# EAGLE design Pinball10 (EAGLE 7.7.0)

## Sheet 1 of 7: Main
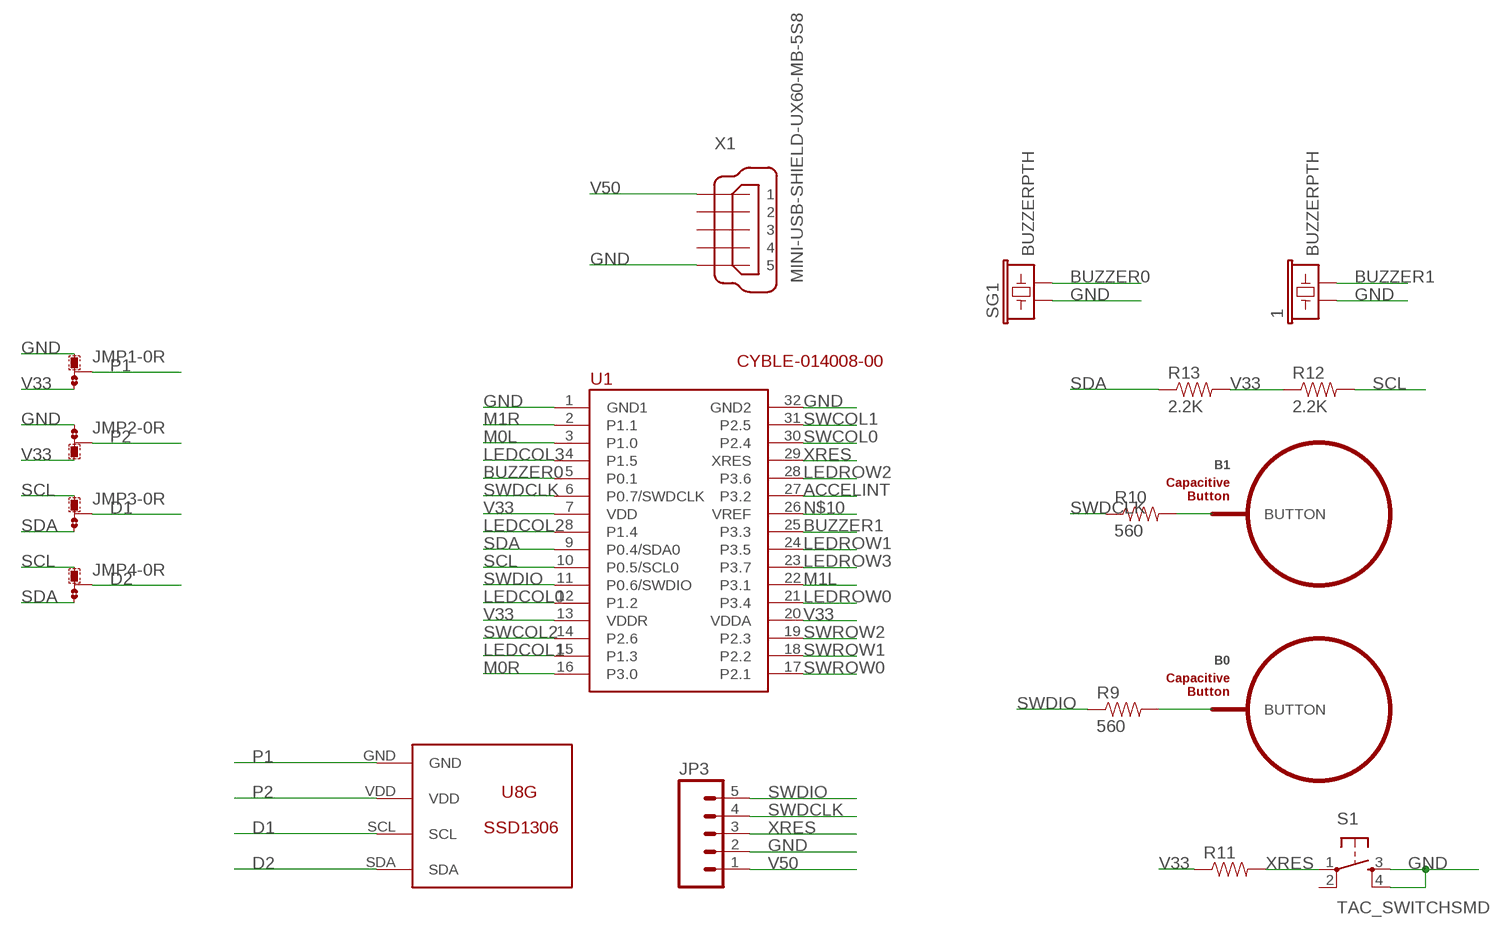
[diagram p0: schematic, sheet 1]

### Parts
1  BUZZERPTH  [BUZZER-12MM]
B0  BUTTON_PASSIVE12MM  [BUTTON_PASSIVE_12MM]
B1  BUTTON_PASSIVE12MM  [BUTTON_PASSIVE_12MM]
JMP1  0R-JUMPB  [B0R-JMP]
JMP2  0R-JUMPB  [B0R-JMP]
JMP3  0R-JUMPB  [B0R-JMP]
JMP4  0R-JUMPB  [B0R-JMP]
JP3  M05LOCK  [1X05_LOCK]
R9  560  RESISTOR0805-RES  [0805]
R10  560  RESISTOR0805-RES  [0805]
R11  RESISTOR0805-RES  [0805]
R12  2.2K  RESISTOR0805-RES  [0805]
R13  2.2K  RESISTOR0805-RES  [0805]
S1  TAC_SWITCHSMD  [TACTILE-SWITCH-SMD]
SG1  BUZZERPTH  [BUZZER-12MM]
U1  CYBLE-014008-00  [PSOC-BLE-11MM-32]
U$2  U8G-096-OLED  [096-SSD1306]
X1  MINI-USB-SHIELD-UX60-MB-5S8  [UX60-MB-5S8]

### Nets
ACCELINT: U1.27(P3.2)
BUZZER0: SG1.- U1.5(P0.1)
BUZZER1: 1.- U1.25(P3.3)
D1: JMP3.2 U$2.SCL
D2: JMP4.2 U$2.SDA
GND [power]: 1.+ JMP1.1 JMP2.1 JP3.2 S1.3 S1.4 SG1.+ U1.1(GND1) U1.32(GND2) X1.5 ; also sheet 4,5,6,7
LEDCOL0: U1.12(P1.2) ; also sheet 2
LEDCOL1: U1.15(P1.3) ; also sheet 2
LEDCOL2: U1.8(P1.4) ; also sheet 2
LEDCOL3: U1.4(P1.5) ; also sheet 2
LEDROW0: U1.21(P3.4) ; also sheet 2
LEDROW1: U1.24(P3.5) ; also sheet 2
LEDROW2: U1.28(P3.6) ; also sheet 2
LEDROW3: U1.23(P3.7) ; also sheet 2
M0L: U1.3(P1.0) ; also sheet 6
M0R: U1.16(P3.0) ; also sheet 6
M1L: U1.22(P3.1) ; also sheet 6
M1R: U1.2(P1.1) ; also sheet 6
N$3: B0.BUTTON R9.2
N$10: U1.26(VREF)
N$11: B1.BUTTON R10.2
P1 [power]: JMP1.2 U$2.GND
P2 [power]: JMP2.2 U$2.VDD
SCL: JMP3.1 JMP4.1 R12.2 U1.10(P0.5/SCL0) ; also sheet 4
SDA: JMP3.3 JMP4.3 R13.1 U1.9(P0.4/SDA0) ; also sheet 4
SWCOL0: U1.30(P2.4) ; also sheet 3
SWCOL1: U1.31(P2.5) ; also sheet 3
SWCOL2: U1.14(P2.6) ; also sheet 3
SWDCLK: JP3.4 R10.1 U1.6(P0.7/SWDCLK)
SWDIO: JP3.5 R9.1 U1.11(P0.6/SWDIO)
SWROW0: U1.17(P2.1) ; also sheet 3
SWROW1: U1.18(P2.2) ; also sheet 3
SWROW2: U1.19(P2.3) ; also sheet 3
V33 [power]: JMP1.3 JMP2.3 R11.1 R12.1 R13.2 U1.7(VDD) U1.13(VDDR) U1.20(VDDA) ; also sheet 4,5,6,7
V50 [power]: JP3.1 X1.1 ; also sheet 5,6,7
XRES: JP3.3 R11.2 S1.1 U1.29(XRES)
Unconnected: S1.2 X1.2 X1.3 X1.4 X1.M1(S1) X1.M2(S2) X1.M3(S3) X1.M4(S4)

## Sheet 2 of 7: LEDS
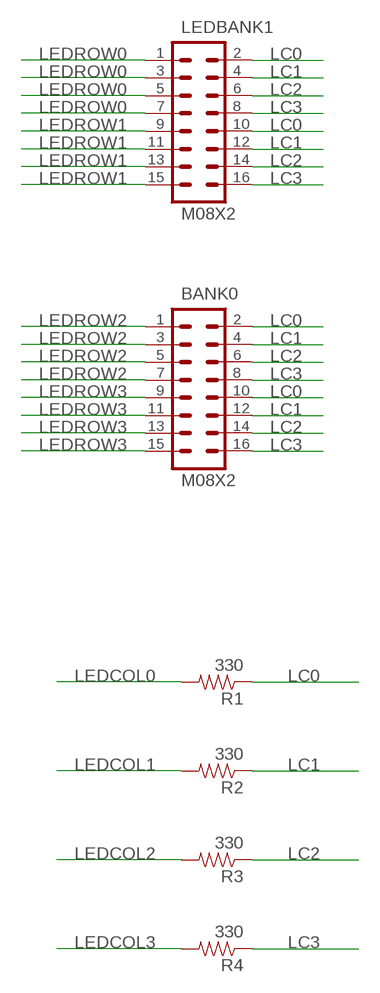
[diagram p1: schematic, sheet 2]

### Parts
BANK0  M08X2  [2X8]
LEDBANK1  M08X2  [2X8]
R1  330  RESISTOR  [0805]
R2  330  RESISTOR  [0805]
R3  330  RESISTOR  [0805]
R4  330  RESISTOR  [0805]

### Nets
LC0: BANK0.2 BANK0.10 LEDBANK1.2 LEDBANK1.10 R1.1
LC1: BANK0.4 BANK0.12 LEDBANK1.4 LEDBANK1.12 R2.1
LC2: BANK0.6 BANK0.14 LEDBANK1.6 LEDBANK1.14 R3.1
LC3: BANK0.8 BANK0.16 LEDBANK1.8 LEDBANK1.16 R4.1
LEDCOL0: R1.2 ; also sheet 1
LEDCOL1: R2.2 ; also sheet 1
LEDCOL2: R3.2 ; also sheet 1
LEDCOL3: R4.2 ; also sheet 1
LEDROW0: LEDBANK1.1 LEDBANK1.3 LEDBANK1.5 LEDBANK1.7 ; also sheet 1
LEDROW1: LEDBANK1.9 LEDBANK1.11 LEDBANK1.13 LEDBANK1.15 ; also sheet 1
LEDROW2: BANK0.1 BANK0.3 BANK0.5 BANK0.7 ; also sheet 1
LEDROW3: BANK0.9 BANK0.11 BANK0.13 BANK0.15 ; also sheet 1

## Sheet 3 of 7: switches
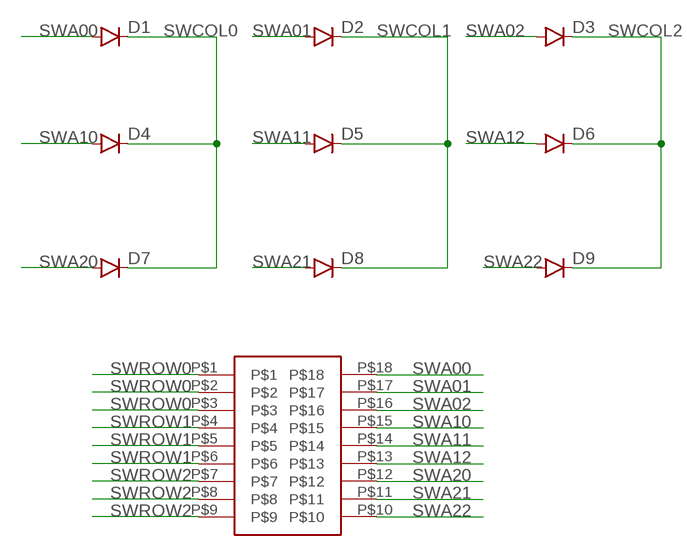
[diagram p2: schematic, sheet 3]

### Parts
D1  DIODESOD  [SOD-323]
D2  DIODESOD  [SOD-323]
D3  DIODESOD  [SOD-323]
D4  DIODESOD  [SOD-323]
D5  DIODESOD  [SOD-323]
D6  DIODESOD  [SOD-323]
D7  DIODESOD  [SOD-323]
D8  DIODESOD  [SOD-323]
D9  DIODESOD  [SOD-323]
U$1  9X2  [9X2]

### Nets
SWA00: D1.A U$1.P$18
SWA01: D2.A U$1.P$17
SWA02: D3.A U$1.P$16
SWA10: D4.A U$1.P$15
SWA11: D5.A U$1.P$14
SWA12: D6.A U$1.P$13
SWA20: D7.A U$1.P$12
SWA21: D8.A U$1.P$11
SWA22: D9.A U$1.P$10
SWCOL0: D1.C D4.C D7.C ; also sheet 1
SWCOL1: D2.C D5.C D8.C ; also sheet 1
SWCOL2: D3.C D6.C D9.C ; also sheet 1
SWROW0: U$1.P$1 U$1.P$2 U$1.P$3 ; also sheet 1
SWROW1: U$1.P$4 U$1.P$5 U$1.P$6 ; also sheet 1
SWROW2: U$1.P$7 U$1.P$8 U$1.P$9 ; also sheet 1

## Sheet 4 of 7: Acceleromter
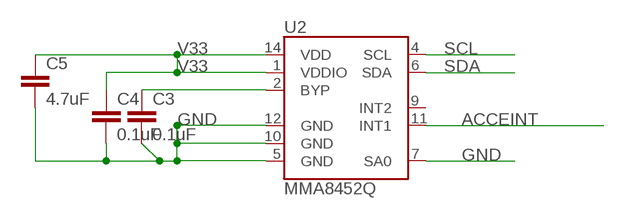
[diagram p3: schematic, sheet 4]

### Parts
C3  0.1uF  CAP0805  [0805]
C4  0.1uF  CAP0805  [0805]
C5  4.7uF  CAP0805  [0805]
U2  MMA8452Q  [QFN-16_0.5MM]

### Nets
ACCEINT: U2.11(INT1)
GND [power]: C3.2 C4.2 C5.2 U2.5(GND) U2.7(SA0) U2.10(GND) U2.12(GND) ; also sheet 1,5,6,7
N$27: C3.1 U2.2(BYP)
SCL: U2.4(SCL) ; also sheet 1
SDA: U2.6(SDA) ; also sheet 1
V33 [power]: C4.1 C5.1 U2.1(VDDIO) U2.14(VDD) ; also sheet 1,5,6,7
Unconnected: U2.9(INT2)

## Sheet 5 of 7: Power
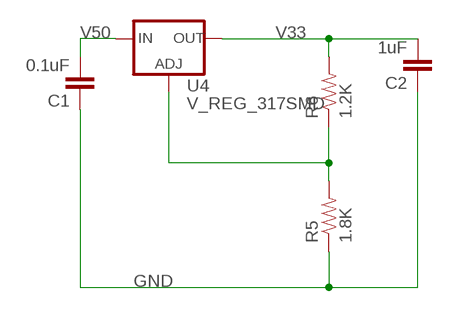
[diagram p4: schematic, sheet 5]

### Parts
C1  0.1uF  CAP0805  [0805]
C2  1uF  CAP0805  [0805]
R5  1.8K  RESISTOR0805-RES  [0805]
R6  1.2K  RESISTOR0805-RES  [0805]
U4  V_REG_317SMD  [SOT223]

### Nets
GND [power]: C1.1 C2.1 R5.1 ; also sheet 1,4,6,7
N$1: R5.2 R6.1 U4.1(ADJ)
V33 [power]: C2.2 R6.2 U4.2(OUT) ; also sheet 1,4,6,7
V50 [power]: C1.2 U4.3(IN) ; also sheet 1,6,7

## Sheet 6 of 7: MOTORS
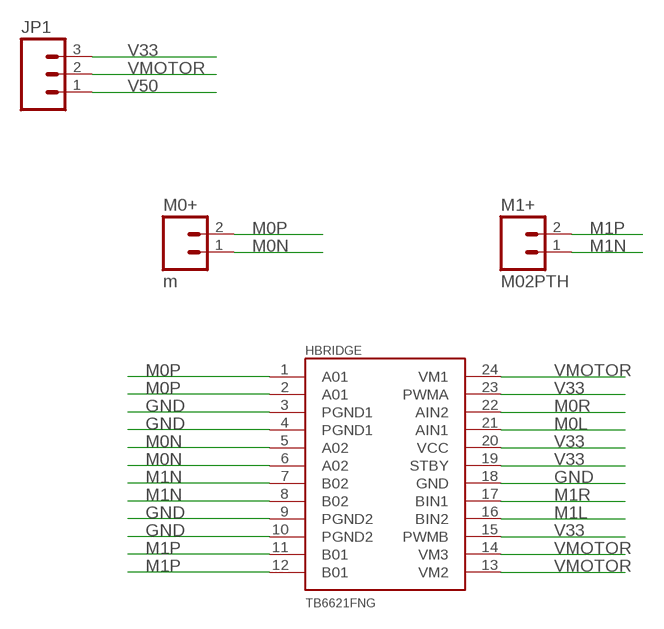
[diagram p5: schematic, sheet 6]

### Parts
HBRIDGE  TB6621FNG  [SSOP24]
JP1  M03PTH  [1X03]
M0+  m  M02PTH  [1X02]
M1+  M02PTH  [1X02]

### Nets
GND [power]: HBRIDGE.3(PGND1) HBRIDGE.4(PGND1) HBRIDGE.9(PGND2) HBRIDGE.10(PGND2) HBRIDGE.18(GND) ; also sheet 1,4,5,7
M0L: HBRIDGE.21(AIN1) ; also sheet 1
M0N: HBRIDGE.5(A02) HBRIDGE.6(A02) M0+.1
M0P: HBRIDGE.1(A01) HBRIDGE.2(A01) M0+.2
M0R: HBRIDGE.22(AIN2) ; also sheet 1
M1L: HBRIDGE.16(BIN2) ; also sheet 1
M1N: HBRIDGE.7(B02) HBRIDGE.8(B02) M1+.1
M1P: HBRIDGE.11(B01) HBRIDGE.12(B01) M1+.2
M1R: HBRIDGE.17(BIN1) ; also sheet 1
V33 [power]: HBRIDGE.15(PWMB) HBRIDGE.19(STBY) HBRIDGE.20(VCC) HBRIDGE.23(PWMA) JP1.3 ; also sheet 1,4,5,7
V50 [power]: JP1.1 ; also sheet 1,5,7
VMOTOR: HBRIDGE.13(VM2) HBRIDGE.14(VM3) HBRIDGE.24(VM1) JP1.2

## Sheet 7 of 7: Test Points
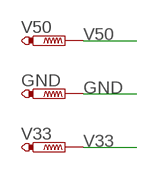
[diagram p6: schematic, sheet 7]

### Parts
GND  GND  PTR1PAD1-13  [P1-13]
V33  PTR1PAD1-13  [P1-13]
V50  PTR1PAD1-13  [P1-13]

### Nets
GND [power]: GND.TP ; also sheet 1,4,5,6
V33 [power]: V33.TP ; also sheet 1,4,5,6
V50 [power]: V50.TP ; also sheet 1,5,6

## Library data of the parts
1 SG1 = SparkFun-Electromechanical:BUZZER: Buzzer 12mm Spark Fun Electronics SKU : Comp-Buzzer
B0 B1 = PatternAgents-TouchWidgets:BUTTON_PASSIVE: Button, Passive Capacitive/Touch Sensing Type Source : http://www.PatternAgents.com Github : https://github.com/PatternAgents License : http://creativecommons.org/licenses/by-sa/3.1/ (Creative Commons 3.1) THIS SOFTWARE IS PROVIDED BY THE CONTRIBUTORS "AS IS" AND WITHOUT ANY EXPRESS OR IMPLIED WARRANTIES, INCLUDING, BUT NOT LIMITED TO, THE IMPLIED WARRANTIES OF MERCHANTABILITY AND FITNESS FOR A PARTICULAR PURPOSE ARE DISCLAIMED. IN NO EVENT SHALL THE COPYRIGHT OWNER OR CONTRIBUTORS BE LIABLE FOR ANY DIRECT, INDIRECT, INCIDENTAL, SPECIAL, EXEMPLARY, OR CONSEQUENTIAL DAMAGES (INCLUDING, BUT NOT LIMITED TO, PROCUREMENT OF SUBSTITUTE GOODS OR SERVICES; LOSS OF USE, DATA, OR PROFITS; OR BUSINESS INTERRUPTION) HOWEVER CAUSED AND ON ANY THEORY OF LIABILITY, WHETHER IN CONTRACT, STRICT LIABILITY, OR TORT (INCLUDING NEGLIGENCE OR OTHERWISE) ARISING IN ANY WAY OUT OF THE USE OF THIS SOFTWARE, EVEN IF ADVISED OF THE POSSIBILITY OF SUCH DAMAGE.
BANK0 LEDBANK1 = SparkFun-Connectors:M08X2: .1" headers, two rows of 8 each
C1-C5 = SparkFun-Capacitors:CAP: Capacitor Standard 0603 ceramic capacitor, and 0.1" leaded capacitor.
D1-D9 = SparkFun-DiscreteSemi:DIODE: Diode These are standard reverse protection diodes and small signal diodes. SMA package can handle up to about 1A. SOD-323 can handle about 200mA. What the SOD-323 package when ordering, there are some mfgs out there that are 5-pin packages.; PROD_ID: DIO-09646
GND V33 V50 = testpad:PTR1: TEST PIN
HBRIDGE = SparkFun:TB6621FNG: Toshiba 1A motor driver
JMP1-JMP4 = jump-0r-smd:0R-JUMP: SMD 0R 0805 Jumper
JP1 = SparkFun-Connectors:M03: Header 3 Standard 3-pin 0.1" header. Use with straight break away headers (SKU : PRT-00116), right angle break away headers (PRT-00553), swiss pins (PRT-00743), machine pins (PRT-00117), and female headers (PRT-00115). Molex polarized connector foot print use with SKU : PRT-08232 with associated crimp pins and housings.
JP3 = SparkFun-Connectors:M05: Header 5 Standard 5-pin 0.1" header. Use with straight break away headers (SKU : PRT-00116), right angle break away headers (PRT-00553), swiss pins (PRT-00743), machine pins (PRT-00117), and female headers (PRT-00115). Molex polarized connector foot print use with SKU : PRT-08230 with associated crimp pins and housings.
M0+ M1+ = SparkFun-Connectors:M02: Standard 2-pin 0.1" header. Use with - straight break away headers ( PRT-00116) - right angle break away headers (PRT-00553) - swiss pins (PRT-00743) - machine pins (PRT-00117) - female headers (PRT-00115) Molex polarized connector foot print use with: PRT-08233 with associated crimp pins and housings. 2.54_SCREWTERM for use with PRT-10571. 3.5mm Screw Terminal footprints for PRT-08084 5mm Screw Terminal footprints for use with PRT-08432
R1-R4 = SparkFun:RESISTOR: Resistor
R5 R6 R9 R10 R12 R13 = SparkFun-Passives:RESISTOR: Resistor
R11 = SparkFun-Resistors:RESISTOR: Resistor
S1 = SparkFun-Electromechanical:TAC_SWITCH: Momentary Switch Button commonly used for reset or general input. Spark Fun Electronics SKU : COM-00097 SMT- SWCH-08247; PROD_ID: SWCH-08247
U1 = PatternAgents-Cypress:CYBLE-014008-00: Cypress PSoC® 4 - Programmable System on Chip, Cortex-M0 Based , Bluetooth Radio Module http://www.cypress.com/?mpn=CYBLE-014008-00 LBR Source: http://www.patternagents.com THIS SOFTWARE IS PROVIDED BY THE CONTRIBUTORS "AS IS" AND WITHOUT ANY EXPRESS OR IMPLIED WARRANTIES, INCLUDING, BUT NOT LIMITED TO, THE IMPLIED WARRANTIES OF MERCHANTABILITY AND FITNESS FOR A PARTICULAR PURPOSE ARE DISCLAIMED. IN NO EVENT SHALL THE COPYRIGHT OWNER OR CONTRIBUTORS BE LIABLE FOR ANY DIRECT, INDIRECT, INCIDENTAL, SPECIAL, EXEMPLARY, OR CONSEQUENTIAL DAMAGES (INCLUDING, BUT NOT LIMITED TO, PROCUREMENT OF SUBSTITUTE GOODS OR SERVICES; LOSS OF USE, DATA, OR PROFITS; OR BUSINESS INTERRUPTION) HOWEVER CAUSED AND ON ANY THEORY OF LIABILITY, WHETHER IN CONTRACT, STRICT LIABILITY, OR TORT (INCLUDING NEGLIGENCE OR OTHERWISE) ARISING IN ANY WAY OUT OF THE USE OF THIS SOFTWARE, EVEN IF ADVISED OF THE POSSIBILITY OF SUCH DAMAGE.
U2 = SparkFun-Sensors:MMA8452Q: MMA8452Q 3-Axis, 12/8-bit Digital Accelerometer Supply Voltage: 1.6-3.6V Range: +/- 2g, 4g, 8g Interface: I2C, 12-bit and 8-bit ODR: 1.56 Hz - 800 Hz Package: QFN-16 http://cache.freescale.com/files/sensors/doc/data_sheet/MMA8452Q.pdf; PROD_ID: IC-10769
U4 = SparkFun-PowerIC:V_REG_317: Voltage Regulator Standard LM317 adjustable voltage regulator. AOI (Adjust Output Input). Google 'LM317 Calculator' for easy to use app to get the two resistor values needed. 240/720 for 5V output. 240/390 for 3.3V output. Spark Fun Electronics SKU : COM-00527
U$1 = arh:9X2
U$2 = IOTExpert:U8G-096-OLED
X1 = con-hirose:MINI-USB-SHIELD-: MINI USB Connector Source: http://www.hirose.co.jp/cataloge_hp/e24000019.pdf; OC_FARNELL: unknown; OC_NEWARK: unknown

## Net classes
1 power: width 0.152 mm

## Board
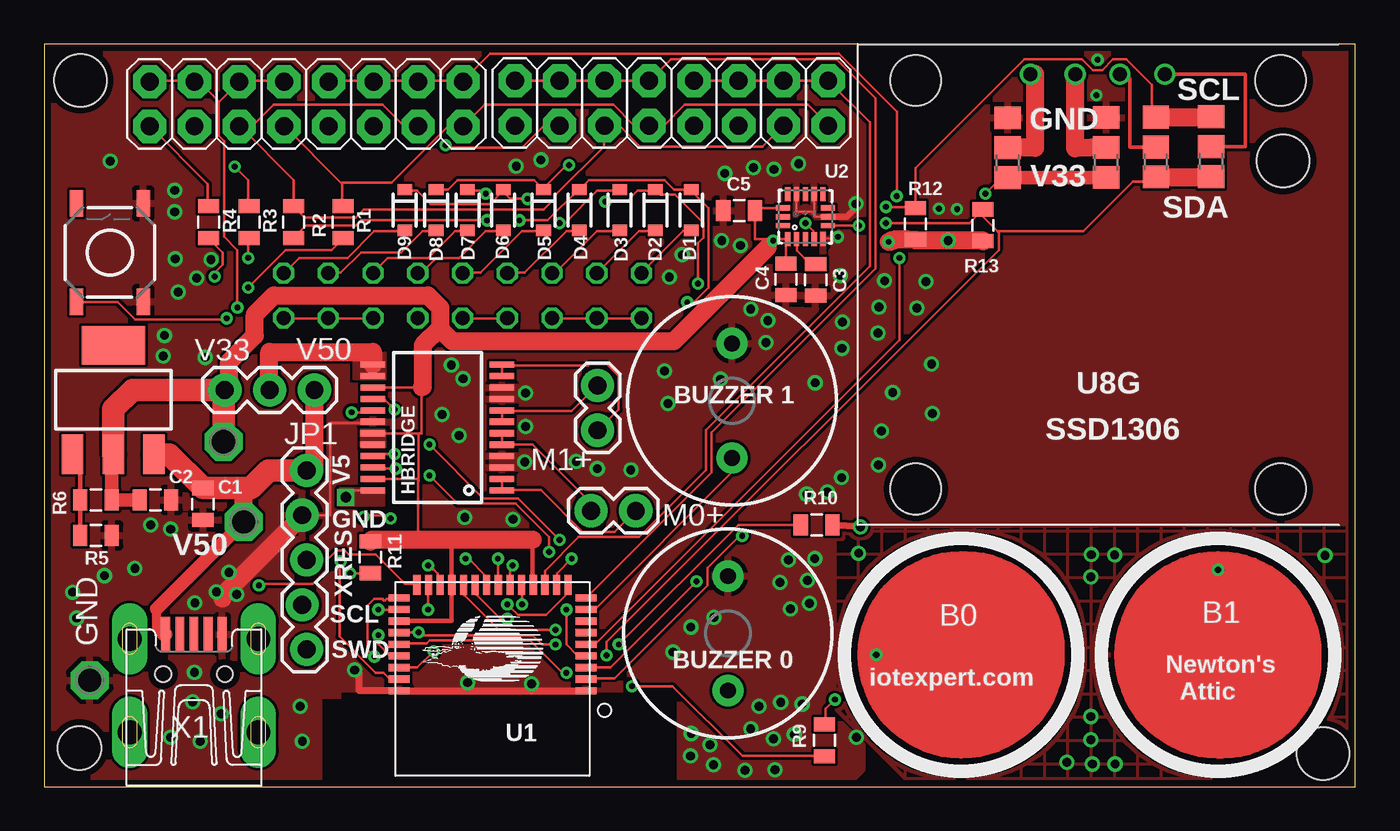
[diagram p7: board, top side]
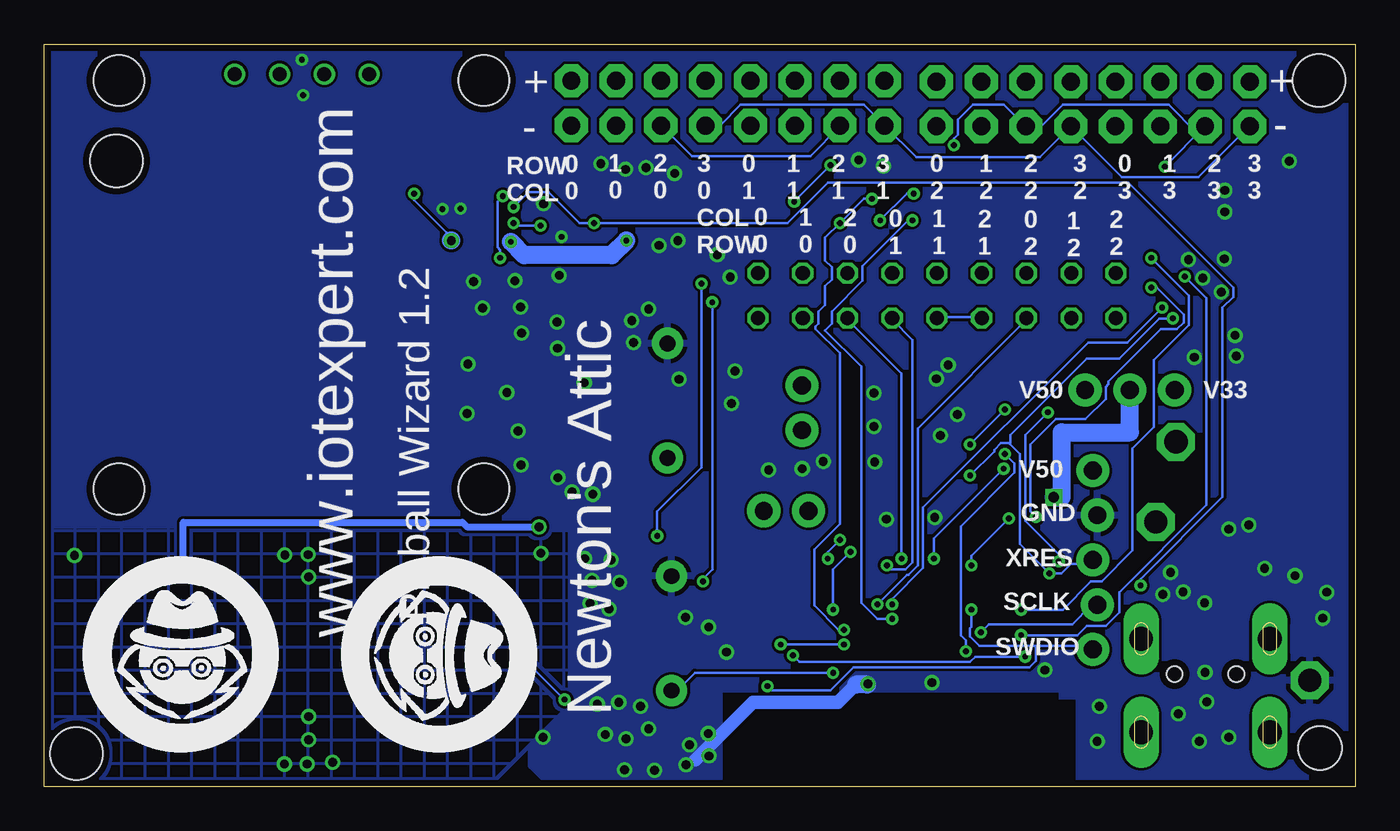
[diagram p8: board, bottom side, seen from below]

Size 74.42 x 42.16 mm. Coordinates in mm from the lower left corner, seen from the top.
Outline: 0,0 74.42,0 74.42,42.16 0,42.16 0,0
Copper layers (1*16): Top 0.0356mm / dielectric 1.5011mm / Bottom 0.0356mm
Design rules "LaenPCBOrder *": minimum track width 6mil, minimum drill 13mil, track to track 6mil, track to pad 6mil, pad to pad 6mil, via to via 6mil, smd to smd 6mil, copper to edge 15mil, drill to drill 6mil, minimum pad ring 7mil, minimum via ring 7mil, stop-mask expansion 3mil, vias tented up to drill 30mil, thermal gap 10mil
Holes 3 mm at 2.06,40.11 72.59,1.88 70.31,35.53
Holes 2.49 mm at 2.01,2.21
tRestrict: area 16.9,-3.7 to 35.9,5.3
bRestrict: area 16.9,-3.7 to 35.9,5.3

### Footprints (pad centres in the part's own frame; a part is rotated, then mirrored left to right if it is on the bottom)
BUZZER-12MM = drill 0.9 pad 1.778: + 3.25,0; - -3.25,0
BUTTON_PASSIVE_12MM = drill 0.356: BUTTON 0,4.826
2X8 = drill 1.016 pad 1.88 octagon: 1 0,0; 2 0,2.54; 3 2.54,0; 4 2.54,2.54; 5 5.08,0; 6 5.08,2.54; 7 7.62,0; 8 7.62,2.54; 9 10.16,0; 10 10.16,2.54; 11 12.7,0; 12 12.7,2.54; 13 15.24,0; 14 15.24,2.54; 15 17.78,0; 16 17.78,2.54
0805 = smd 0.8 x 1.2: 1 -0.9,0; 2 0.9,0
SOD-323 = smd 0.63 x 0.83: A 1.15,0; C -1.15,0
P1-13 = drill 1.321 pad 2.159 octagon: TP 0,0
SSOP24 = smd 0.348 x 1.397: 1 -3.575,-3.656; 2 -2.925,-3.656; 3 -2.275,-3.656; 4 -1.625,-3.656; 5 -0.975,-3.656; 6 -0.325,-3.656; 7 0.325,-3.656; 8 0.975,-3.656; 9 1.625,-3.656; 10 2.275,-3.656; 11 2.925,-3.656; 12 3.575,-3.656; 13 3.575,3.656; 14 2.925,3.656; 15 2.275,3.656; 16 1.625,3.656; 17 0.975,3.656; 18 0.325,3.656; 19 -0.325,3.656; 20 -0.975,3.656; 21 -1.625,3.656; 22 -2.275,3.656; 23 -2.925,3.656; 24 -3.575,3.656
B0R-JMP = smd 1.5 x 1.3: 1 0,1.7; 2 0,0; 3 0,-1.7
1X03 = drill 1.016 pad 1.88: 1 0,0; 2 2.54,0; 3 5.08,0
1X05_LOCK = drill 1.016 pad 1.88: 1 0,0.127; 2 2.54,-0.127; 3 5.08,0.127; 4 7.62,-0.127; 5 10.16,0.127
1X02 = drill 1.016 pad 1.88: 1 0,0; 2 2.54,0
TACTILE-SWITCH-SMD = smd 1.524 x 0.762: 1 -2.794,1.905; 2 2.794,1.905; 3 -2.794,-1.905; 4 2.794,-1.905
PSOC-BLE-11MM-32 = smd 1.2 x 0.41: 1 5.31,0.67; 2 5.31,0.01; 3 5.31,-0.65; 4 5.31,-1.31; 5 5.31,-1.97; 6 5.31,-2.63; 7 5.31,-3.29; 8 5.31,-3.95; 9 5.31,-4.61; 24 -5.31,-4.61; 25 -5.31,-3.95; 26 -5.31,-3.29; 27 -5.31,-2.63; 28 -5.31,-1.97; 29 -5.31,-1.31; 30 -5.31,-0.65; 31 -5.31,0.01; 32 -5.31,0.67 | smd 0.41 x 1.15: 10 4.29,-5.335; 11 3.63,-5.335; 12 2.97,-5.335; 13 2.31,-5.335; 14 1.65,-5.335; 15 0.99,-5.335; 16 0.33,-5.335; 17 -0.33,-5.335; 18 -0.99,-5.335; 19 -1.65,-5.335; 20 -2.31,-5.335; 21 -2.97,-5.335; 22 -3.63,-5.335; 23 -4.29,-5.335
QFN-16_0.5MM = smd 0.8 x 0.3: 1 -1.275,1; 2 -1.275,0.5; 3 -1.275,0; 4 -1.275,-0.5; 5 -1.275,-1; 9 1.275,-1; 10 1.275,-0.5; 11 1.275,0; 12 1.275,0.5; 13 1.275,1 | smd 0.3 x 0.8: 6 -0.5,-1.275; 7 0,-1.275; 8 0.5,-1.275; 14 0.5,1.275; 15 0,1.275; 16 -0.5,1.275
SOT223 = smd 1.219 x 2.235: 1 -2.311,-3.099; 2 0,-3.099; 3 2.311,-3.099 | smd 3.6 x 2.2: 4 0,3.099
9X2 = drill 0.8 octagon: P$1 0,0; P$2 0,2.54; P$3 0,5.08; P$4 0,7.62; P$5 0,10.16; P$6 0,12.7; P$7 0,15.24; P$8 0,17.78; P$9 0,20.32; P$10 2.54,20.32; P$11 2.54,17.78; P$12 2.54,15.24; P$13 2.54,12.7; P$14 2.54,10.16; P$15 2.54,7.62; P$16 2.54,5.08; P$17 2.54,2.54; P$18 2.54,0
096-SSD1306 = drill 0.8: GND 9.8,25.6; SCL 14.88,25.6; SDA 17.42,25.6; VDD 12.34,25.6 | hole 2.88: 3.3,2.05; 24,2.05; 24,25.25; 3.3,25.25
UX60-MB-5S8 = smd 2 x 0.5: 1 8.65,1.6; 2 8.65,0.8; 3 8.65,0; 4 8.65,-0.8; 5 8.65,-1.6 | drill 1.35 long: M1 3.1,-3.65; M2 3.1,3.65; M3 8.4,3.65; M4 8.4,-3.65 | hole 0.9: 6.4,-1.75; 6.4,1.75

### Placement (x,y rotation side)
1  39.04,21.92 90 top
B0  52.04,7.49 90 top
B1  66.62,7.49 0 top
BANK0  23.77,40.03 180 top
C1  9.02,16.05 90 top
C2  6.32,16.28 180 top
C3  43.79,28.78 270 top
C4  42.11,28.8 270 top
C5  39.45,32.72 180 top
D1  36.73,32.74 270 top
D2  34.7,32.74 270 top
D3  32.66,32.74 270 top
D4  30.38,32.74 270 top
D5  28.35,32.74 270 top
D6  26.06,32.74 270 top
D7  24.03,32.74 270 top
D8  22.25,32.74 270 top
D9  20.47,32.74 270 top
GND  2.59,6.05 0 top
HBRIDGE  22.33,20.4 90 top
JMP1  54.69,36.27 0 top
JMP2  60.27,36.3 0 top
JMP3  63.09,36.32 0 top
JMP4  66.22,36.35 0 top
JP1  15.34,22.53 180 top
JP3  14.78,17.96 270 top
LEDBANK1  44.5,40.08 180 top
M0+  31.04,15.67 0 top
M1+  31.42,22.78 270 top
R1  16.97,32.05 270 top
R2  14.17,32.05 270 top
R3  11.63,32.05 270 top
R4  9.35,32.05 270 top
R5  2.95,14.27 180 top
R6  2.95,16.28 0 top
R9  44.3,2.64 90 top
R10  43.84,14.86 0 top
R11  18.52,13.03 270 top
R12  49.45,31.95 90 top
R13  53.29,31.88 270 top
S1  3.73,30.33 90 top
SG1  38.81,8.71 90 top
U1  25.45,6.12 180 top
U2  43.21,32.36 90 top
U4  3.94,21.97 0 top
U$1  33.91,26.62 90 top
U$2  46.18,14.86 0 top
V33  10.19,19.58 0 top
V50  11.33,15.04 0 top
X1  8.51,0 90 top

### Tracks (layer width: path | path; a pad name or v marks a point on that pad's centre or on a via)
BUZZER0  (via drill 0.33)
  Top 0.152: v29.64,6.48 29.41,6.48 27.58,8.31 21.87,8.31 21.72,8.15 20.19,8.15 U1.5
  Bottom 0.152: v29.64,6.48 37.49,6.48 38.48,5.49 38.79,5.49 SG1.-
BUZZER1
  Top 0.152: U1.25 30.79,10.13 31.32,10.13 39.01,17.83 39.01,18.67 1.-
D1
  Top 0.203: JMP3.2 61.62,36.32 61.62,40.18 61.06,40.18 U$2.SCL
  Bottom 0.152: 61.04,40.39 U$2.SCL
D2
  Top 0.203: JMP4.2 68.17,36.35 68.17,40.46 U$2.SDA
GND  (via drill 0.33, 0.5)
  Top 0.152: U2.5 v45.06,31.22 | U2.7 43.71,32.36 43.71,32.64 | 43.71,32.64 U2.10 | U2.12 42.7,32.64 43.71,32.64 | HBRIDGE.18 18.6,20.65 16.23,20.65 16.23,15.42 JP3.2
  Top 0.381: U2.7 45.57,32.36 46.08,32.87 v46.08,33.1
  Top 0.406: U1.32 U1.1 17.88,5.45 17.88,6.43
  Top 1.016: 10.13,10.69 10.13,10.87 14.53,15.27
  Bottom 0.762: 28.35,5.82 29.36,4.8 34.19,4.8 37.47,1.52
  Bottom 1.016: 27.71,5.82 28.35,5.82
  other vias: 17.63,6.63 14.66,2.59 14.53,4.57 24.03,5.92 27.66,5.84 1.85,9.58 1.63,11.05 3.43,11.99 38.46,31.01 39.52,30.73 38.63,34.82 40.26,35.15 42.82,35.38 41.43,35.05 36.22,30.2 35.48,28.93 50.04,28.68 47.7,28.73 47.37,27.23 45.31,26.39 45.29,24.89 43.76,22.94 47.32,25.76 49.53,27.18 51.82,32.79 50.77,32.82 48.16,22.38 47.52,20.19 47.35,18.26 50.42,21.18 50.37,24 45.26,17.55 43.28,16.61 44.45,16.74 43.74,12.95 42.24,12.88 41.76,11.61 42.37,10.11 43.33,11.71 43.43,10.41 28.19,35.59 26.8,35.23 5.16,12.4 7.19,14.63 6.05,14.86 8.53,6.5 8.43,4.83 7.19,2.82 8.86,2.59 10.06,4.14 36.73,3.02 36.68,1.75 38,1.24 37.8,2.39 39.78,0.94 41.48,0.97 42.57,2.97 41.4,2.72 40.11,3.3 40.56,4.57 41.81,4.8 43.03,4.7 27.33,22.35 9.47,29.92 8.66,28.88 7.62,28.09 7.44,29.97 7.42,32.64 7.42,33.86 3.76,35.51 6.83,25.63 6.76,24.46 9.14,24.38 45.19,29.03 23.11,23.95 23.77,23.16 22.58,21.13 23.55,19.94 27.33,20.45 27.28,18.44 30.2,18.47 31.39,18.06 33.3,17.98 26.62,15.19 23.88,15.29 40.11,27.13 41.07,26.47 40.97,25.22 38.38,23.14 35.2,23.6 35.41,21.77 10.49,12.17 8.56,10.44 9.78,11.07 10.92,10.92 35.69,7.65 36.7,9.07 38.02,9.63 59.44,13.18 59.41,11.91 59.41,3.99 59.41,2.67 59.49,1.3 58.04,1.4 60.78,1.3 46.1,2.82 72.69,13.13 46.23,13.26 60.76,13.16 59.72,39.27 59.79,41.27
  pour Top (rank 2): -0.28,42.39 -0.56,42.11 -0.56,-1.3 0.3,-0.43 15.75,-0.43 15.62,-0.3 15.62,5.08 15.72,5.18 34.85,5.18 35.03,5 35.03,-0.56 35.56,-0.03 45.42,-0.03 46.43,0.99 46.43,2.36 44.65,4.14 44.65,15.19 45.01,14.83 74.73,15.01 74.73,42.27 74.57,42.42 -0.28,42.42
  pour Bottom (rank 2): -0.23,42.52 -0.61,42.14 -0.61,-0.56 -0.48,-0.43 15.62,-0.43 15.67,-0.38 15.67,5.13 35.03,5.13 35.03,-0.23 35.08,-0.18 45.39,-0.18 46.76,1.19 46.76,2.21 44.5,4.47 44.5,14.88 44.63,14.76 74.83,14.83 74.83,42.6 74.75,42.52 -0.18,42.52
  pour Top (no thermals): 25.3,17.96 27.81,17.96 27.81,18.92 25.3,18.92
  pour Top (no thermals): 25.35,21.84 27.86,21.84 27.86,22.81 25.35,22.81
  pour Top (rank 3, hatched): 44.86,14.88 74.42,14.88 74.83,14.48 74.83,0.15 74.24,-0.43 49.71,-0.43 44.12,5.16 44.12,14.12 44.86,14.86
  pour Bottom (rank 3, hatched): 44.73,14.86 74.3,14.86 74.7,14.45 74.7,0.13 74.12,-0.46 49.58,-0.46 43.99,5.13 43.99,14.1 44.73,14.83
LC0
  Top 0.152: LEDBANK1.2 44.5,37.57 43.36,38.71 36.35,38.71 35.2,37.57 34.37,37.57 LEDBANK1.10 34.29,37.57 33.45,37.57 32.31,38.71 24.99,38.71 BANK0.2 22.94,37.49 19.74,34.29 16.92,34.29 16.88,34.25 | 16.88,34.25 13.64,37.49 BANK0.10 | 16.88,34.25 16.92,34.21 16.92,32.99 R1.1
LC1
  Top 0.152: LEDBANK1.4 40.77,36.35 33.83,36.35 32.69,37.49 31.85,37.49 LEDBANK1.12 31.77,37.49 31.77,36.35 29.03,33.6 29.03,33.45 28.35,32.77 18.14,32.77 17.68,32.31 14.78,32.31 14.17,32.92 R2.1 14.17,34.44 11.12,37.49 BANK0.12 11.51,37.19 13.03,38.71 19.2,38.71 20.42,37.49 BANK0.4
LC2  (via drill 0.33)
  Top 0.152: v10.82,35.2 11.58,34.44 11.58,32.99 R3.1 | v22.78,36.42 22.94,36.27 27.13,36.27 28.35,37.49 29.26,37.49 LEDBANK1.14
  Bottom 0.152: LEDBANK1.14 29.26,37.49 30.94,35.81 37.64,35.81 39.4,37.57 LEDBANK1.6 | v10.82,35.2 BANK0.14 8.99,37.11 10.59,38.71 16.61,38.71 17.83,37.49 BANK0.6 18.75,37.49 19.96,38.71 21.72,38.71 22.55,37.87 22.55,37.03 22.78,36.8 v22.78,36.42
LC3
  Top 0.152: R4.1 9.3,32.99 9.3,34.21 6.02,37.49 BANK0.16
  Bottom 0.152: LEDBANK1.8 36.88,37.57 36.04,37.57 34.9,38.71 27.89,38.71 LEDBANK1.16 24.92,35.74 17.91,35.74 BANK0.8 13.26,34.59 8.91,34.59 6.02,37.49 BANK0.16
LEDCOL0  (via drill 0.33)
  Top 0.152: v21.79,12.57 22.02,12.34 22.1,12.34 22.33,12.12 22.33,12.04 22.48,11.89 22.48,11.51 U1.12 | v19.66,15.24 19.51,15.39 18.21,15.39 v18.14,15.32 | v11.58,28.35 13.72,30.48 16.31,30.48 16.92,31.09 R1.2
  Bottom 0.152: v21.79,12.57 21.79,13.11 v19.66,15.24 | v18.14,15.32 18.44,15.62 18.44,19.43 16.99,20.88 15.32,20.88 14.17,22.02 14.17,22.71 14.02,22.86 14.02,23.01 11.05,25.98 10.13,25.98 9.75,26.36 9.75,26.82 11.28,28.35 v11.58,28.35
LEDCOL1  (via drill 0.33)
  Top 0.152: v26.29,9.53 25.91,9.53 24.54,10.9 24.54,11.43 U1.15 | v25.15,32.16 17.98,32.16 17.68,31.85 14.86,31.85 14.17,31.17 R2.2
  Bottom 0.152: v26.29,9.53 27.13,9.53 28.04,10.44 28.04,23.85 30.1,25.91 29.72,26.29 29.72,26.98 27.96,28.73 27.96,29.57 25.38,32.16 v25.15,32.16
LEDCOL2  (via drill 0.33)
  Top 0.152: v18.97,10.06 20.12,10.06 U1.8 | v11.58,30.02 11.58,31.09 R3.2
  Bottom 0.152: v18.97,10.06 16.61,10.06 15.01,11.66 14.4,11.66 12.65,13.41 12.65,19.2 11.43,20.42 11.43,24.23 9.45,26.21 9.45,27.89 v11.58,30.02
LEDCOL3  (via drill 0.33)
  Top 0.152: v18.97,8.61 18.97,8.08 19.58,7.47 20.12,7.47 U1.4 | v9.68,28.96 9.68,29.18 10.13,29.64 10.13,30.33 9.37,31.09 R4.2
  Bottom 0.152: v18.97,8.61 15.77,8.61 15.24,9.14 14.17,9.14 13.41,9.91 13.41,11.05 8.46,16 8.46,27.74 v9.68,28.96
LEDROW0
  Top 0.152: LEDBANK1.7 LEDBANK1.5 LEDBANK1.3 LEDBANK1.1 46.86,37.72 46.86,29.57 37.57,20.27 37.57,17.98 33.76,14.17 30.33,14.17 28.42,12.27 28.42,11.51 U1.21
LEDROW1
  Top 0.152: LEDBANK1.15 LEDBANK1.13 LEDBANK1.11 LEDBANK1.9 34.37,40.08 35.59,41.3 44.96,41.3 47.17,39.09 47.17,29.41 37.87,20.12 37.87,17.83 30.79,10.74 U1.24
LEDROW2  (via drill 0.33)
  Top 0.152: BANK0.7 16.15,40.08 18.67,40.08 BANK0.5 18.75,40.08 21.18,40.08 BANK0.3 21.26,40.08 23.77,40.08 | v48.54,30.02 48.54,25.38 31.32,8.15 30.79,8.15 U1.28 | v48.39,33.53 48.39,38.33 45.11,41.6 25.3,41.6 23.77,40.08 | 23.77,40.08 BANK0.1
  Bottom 0.152: v48.54,30.02 48.54,30.48 48.69,30.63 48.69,33.22 v48.39,33.53
LEDROW3  (via drill 0.33)
  Top 0.152: BANK0.15 6.02,40.08 8.53,40.08 BANK0.13 8.53,40.01 8.84,40.01 9.94,38.9 | v26.29,10.36 26.9,9.75 28.5,9.75 29.72,10.97 29.72,11.43 U1.23 | v10.97,27.2 10.97,30.48 10.21,31.24 10.21,36.65 9.91,36.96 9.91,38.86 9.94,38.9 | 9.94,38.9 BANK0.11 11.12,40.08 13.56,40.08 BANK0.9
  Bottom 0.152: v26.29,10.36 26.29,10.67 24.54,12.42 24.54,15.85 15.16,25.22 12.95,25.22 v10.97,27.2
M0L  (via drill 0.33)
  Top 0.152: v22.1,7.7 21.18,6.78 20.19,6.78 U1.3 | v19.89,18.9 18.82,18.9 18.75,18.82 HBRIDGE.21
  Bottom 0.152: v22.1,7.7 22.1,8.31 22.4,8.61 22.4,14.78 19.36,17.83 19.36,18.36 v19.89,18.9
M0N
  Top 0.152: HBRIDGE.6 25.98,20.04 25.98,19.43 HBRIDGE.5 26.06,19.43 27.74,19.43 31.01,16.15 31.01,15.7 M0+.1
M0P
  Top 0.152: HBRIDGE.2 25.98,17.45 25.98,16.84 HBRIDGE.1 26.06,16.84 28.19,16.84 30.56,14.48 32.38,14.48 M0+.2
M0R  (via drill 0.33)
  Top 0.152: v23.93,12.95 24.08,12.95 25.07,11.96 25.07,11.51 U1.16 | v19.96,18.06 18.75,18.06 HBRIDGE.22
  Bottom 0.152: v23.93,12.95 23.93,14.1 v19.96,18.06
M1L  (via drill 0.33)
  Top 0.152: v29.95,12.95 29.11,12.12 29.11,11.51 U1.22 | v29.26,14.02 26.9,16.38 24.92,16.38 v21.87,19.43 | v19.89,21.41 19.36,21.95 18.75,21.95 HBRIDGE.16
  Bottom 0.152: v29.95,12.95 29.95,13.34 v29.26,14.02 | v19.89,21.41 v21.87,19.43
M1N
  Top 0.152: HBRIDGE.7 25.98,21.34 HBRIDGE.8 26.06,21.34 29.95,21.34 31.39,22.78 M1+.1
M1P
  Top 0.152: HBRIDGE.11 25.98,23.39 25.98,23.93 HBRIDGE.12 26.06,23.93 30.86,23.93 30.94,24 31.93,24 32.61,23.32 32.61,21.41 31.47,20.27 M1+.2
M1R  (via drill 0.33)
  Top 0.152: v16.84,12.8 16.76,12.72 16.76,8.53 18.82,6.48 19.28,6.48 19.58,6.17 20.12,6.17 U1.2 | v17.45,21.26 18.59,21.26 18.67,21.34 HBRIDGE.17
  Bottom 0.152: v16.84,12.8 16.84,13.18 18.75,15.09 18.75,19.96 v17.45,21.26
N$1
  Top 0.254: R5.2 R6.1 2.05,18.45 U4.1
N$3  (via drill 0.33)
  Top 0.152: v44.88,4.95 44.35,4.42 44.35,3.58 R9.2
  Bottom 0.152: v44.88,4.95 47.17,7.24 47.17,7.47 B0.BUTTON
N$11  (via drill 0.5)
  Top 0.406: v46.33,14.76 R10.2
  Bottom 0.406: B1.BUTTON 66.52,12.32 66.52,15.01 50.67,15.01 50.42,14.76 v46.33,14.76
N$27
  Top 0.152: U2.2 42.72,31.07 42.72,30.43 43.47,29.68 C3.1
P1
  Top 1.016: U$2.GND 56.24,40.46 56.24,36.27 JMP1.2
P2
  Top 1.016: JMP2.2 58.52,36.25 U$2.VDD
  Bottom 0.152: U$2.VDD
SCL  (via drill 0.33)
  Top 0.152: v43.2,32 43.66,31.55 43.66,31.09 U2.4 | 49.45,32.92 v47.78,32.92 | v12.19,11.43 12.27,11.51 15.24,11.51 16.08,12.34 16.08,12.88 16.61,13.41 17.07,13.41 17.3,13.18 18.82,13.18 20.5,11.51 21.11,11.51 U1.10 | 49.45,32.92 49.45,35.13 55.63,41.3 58.9,41.3 59.51,40.69 60.05,40.69 60.66,41.3 61.42,41.3 62.87,39.85 62.87,38.48 JMP3.1 | 49.45,32.92 R12.2
  Top 1.016: JMP3.1 66.22,38.02 JMP4.1
  Bottom 0.152: v47.78,32.92 46.94,33.76 45.8,33.76 44.04,32 v43.2,32 32.23,32 29.95,34.29 12.88,34.29 6.93,28.35 6.93,27.81 7.54,27.2 7.54,16.46 12.19,11.81 v12.19,11.43
SDA  (via drill 0.33)
  Top 0.152: v46.25,31.85 44.5,31.85 U2.6 | v47.78,32 52.5,32 53.26,32.77 R13.1 53.11,32.54 54.14,31.51 | v18.75,7.39 18.36,7.77 18.36,10.29 18.75,10.67 19.2,10.67 19.28,10.59 19.36,10.59 19.43,10.67 20.12,10.67 U1.9 | v31.93,7.47 31.93,8.23 54.18,30.48 54.18,31.47 54.14,31.51 | JMP3.3 62.64,34.37 61.8,34.37 58.98,31.55 54.18,31.55 54.14,31.51
  Top 1.016: JMP3.3 66.22,34.62 JMP4.3
  Bottom 0.152: v46.25,31.85 47.62,31.85 v47.78,32 | v18.75,7.39 21.57,7.39 21.87,7.09 31.55,7.09 v31.93,7.47
SWA00
  Top 0.152: D1.A 36.73,31.55 36.27,31.55 33.91,29.18 U$1.P$18
SWA01
  Top 0.152: U$1.P$17 33.76,31.55 34.67,31.55 D2.A
SWA02
  Top 0.152: D3.A 32.61,31.55 31.39,31.55 29.03,29.18 28.88,29.18 U$1.P$16
SWA10
  Top 0.152: D4.A 30.33,31.55 29.64,31.55 27.28,29.18 26.29,29.18 U$1.P$15
SWA11
  Top 0.152: D5.A 28.35,31.55 27.13,31.55 24.77,29.18 23.77,29.18 U$1.P$14
SWA12
  Top 0.152: D6.A 26.06,31.55 25.07,31.55 23.55,30.02 22.25,30.02 21.41,29.18 21.26,29.18 U$1.P$13
SWA20
  Top 0.152: D7.A 24,31.55 23.32,31.55 21.79,30.02 19.51,30.02 18.67,29.18 U$1.P$12
SWA21
  Top 0.152: D8.A 22.25,31.55 21.49,31.55 20.27,30.33 17.98,30.33 16.84,29.18 16.15,29.18 U$1.P$11
SWA22
  Top 0.152: D9.A 20.42,31.55 18.75,31.55 17.22,30.02 14.48,30.02 13.64,29.18 U$1.P$10
SWCOL0  (via drill 0.33)
  Top 0.152: v25.07,33.68 24.92,33.83 24.08,33.83 D7.C | v26.98,32.16 28.57,32.16 30.33,33.91 D4.C 30.4,33.91 30.94,34.44 35.2,34.44 35.74,33.91 36.73,33.91 D1.C 36.73,33.83 37.72,32.84 37.72,28.35 36.88,27.51 v36.5,27.51 | v37.03,11.66 32.16,6.78 30.79,6.78 U1.30
  Bottom 0.152: v25.07,33.68 25.45,33.68 v26.98,32.16 | v37.03,11.66 37.03,11.81 36.5,12.34 v36.5,27.51
SWCOL1  (via drill 0.33)
  Top 0.152: D8.C 22.25,33.91 22.94,33.91 23.47,34.44 27.81,34.44 28.35,33.91 D5.C 28.35,33.98 29.64,35.28 v29.79,35.28 | v31.85,33.22 33.07,33.22 33.68,33.83 34.67,33.83 D2.C 34.75,33.83 34.98,33.6 35.81,33.6 37.41,32 37.41,31.17 37.11,30.86 v37.11,28.57 | v39.62,14.25 39.47,14.25 37.64,12.42 37.64,11.43 32.38,6.17 30.79,6.17 U1.31
  Bottom 0.152: v29.79,35.28 v31.85,33.22 | v39.62,14.25 39.62,15.62 37.11,18.14 v37.11,28.57
SWCOL2  (via drill 0.33)
  Top 0.152: D9.C 20.5,33.83 21.18,33.83 21.95,33.07 25.3,33.07 26.06,33.83 D6.C 26.06,33.76 26.44,33.38 v27.43,33.38 | v29.26,32 29.57,32 31.39,33.83 32.61,33.83 D3.C | v29.03,8.91 25.83,8.91 23.85,10.9 23.85,11.43 U1.14
  Bottom 0.152: v27.43,33.38 27.89,33.38 v29.26,32 30.1,31.17 30.1,29.87 29.72,29.49 29.72,28.8 30.1,28.42 30.1,27.36 30.48,26.98 30.48,26.29 30.63,26.14 30.63,25.98 29.26,24.61 29.26,14.94 30.71,13.49 30.71,10.29 29.34,8.91 v29.03,8.91
SWDCLK  (via drill 0.33)
  Top 0.152: U1.6 20.19,8.76 v21.26,8.76 21.41,8.61 27.74,8.61 28.27,8.08 v29.03,8.08 | R10.1 39.4,14.86 v32.61,8.08
  Bottom 0.152: v21.26,8.76 20.8,9.22 16.08,9.22 15.01,10.29 14.71,10.29 JP3.4 | v29.03,8.08 v32.61,8.08
SWDIO  (via drill 0.33)
  Top 0.152: v21.79,10.06 21.79,11.43 U1.11 | v33.38,5.71 35.66,5.71 39.62,1.75 44.27,1.75 R9.1
  Bottom 0.152: v21.79,10.06 21.79,9.07 21.87,8.99 21.87,8.53 21.34,8 18.14,8 | 18.14,8 15.85,8 15.7,7.85 14.94,7.85 JP3.5 | v33.38,5.71 33.15,5.49 29.79,5.49 28.5,6.78 18.52,6.78 18.14,7.16 18.14,8
SWROW0  (via drill 0.33)
  Top 0.152: v25.76,12.95 25.76,11.51 U1.17 | U$1.P$3 28.88,26.59 31.32,26.59 U$1.P$2 31.39,26.59 33.91,26.59 U$1.P$1
  Bottom 0.152: v25.76,12.95 25.76,23.47 28.88,26.59 U$1.P$3
SWROW1  (via drill 0.33)
  Top 0.152: v26.59,12.57 26.44,12.42 26.44,11.51 U1.18 | U$1.P$5 23.77,26.59 26.29,26.59 U$1.P$4
  Bottom 0.152: U$1.P$6 21.26,26.67 23.7,26.67 U$1.P$5 | v26.59,12.57 26.36,12.34 25.53,12.34 25.15,12.72 25.15,25.38 26.29,26.52 U$1.P$4
SWROW2  (via drill 0.33)
  Top 0.152: U$1.P$9 13.64,26.59 16.08,26.59 U$1.P$8 16.15,26.59 18.67,26.59 U$1.P$7 | v27.13,10.36 27.13,11.43 U1.19
  Bottom 0.152: v27.13,10.36 25.45,12.04 25.38,12.04 24.84,12.57 24.84,20.34 18.67,26.52 U$1.P$7
V33  (via drill 0.33, 0.5)
  Top 0.152: HBRIDGE.15 21.44,22.67 21.44,20.07 21.34,20.07 | 21.34,20.07 HBRIDGE.19 | HBRIDGE.23 21.23,17.47 | 21.23,17.47 21.23,14.02 | 21.26,17.47 21.26,20.02 21.34,20.09 21.34,20.07 | 21.26,17.47 21.26,17.37 | 21.23,17.47 21.26,17.47 | U2.14 40.35,32.86 C5.1 40.35,31.09 41.3,31.09 | C4.1 42.11,31.09 U2.1 41.3,31.09 | 41.3,31.09 v41.38,31.01 | v53.42,33.68 54.18,34.44 54.33,34.44 JMP1.3
  Top 0.254: U1.20 27.74,11.46 27.74,14.02 | 23.11,14.02 23.11,11.46 U1.13 23.14,9.41 U1.7
  Top 0.508: 41.07,30.63 v41.38,31.01
  Top 0.762: C2.2 R6.2 3.85,18.78 U4.2 | JMP1.3 60.27,34.57 JMP2.3
  Top 1.016: 27.74,14.02 23.11,14.02 21.23,14.02 18.59,14.02 18.52,13.95 R11.1 | R13.2 53.26,31.01 v51.31,31.01 49.45,31.01 R12.1 49,31.09 48.31,31.09 48.23,31.01 48.08,31.01 48.01,30.94 v47.93,30.94 | 22.44,26.02 22.48,26.06 22.48,27.2 21.79,27.89 13.03,27.89 11.96,26.82 11.96,25.6 10.52,24.16 10.52,23.09 JP1.3 | 22.44,26.02 21.49,25.07 21.49,22.71 21.44,22.67 | 41.07,30.63 35.74,25.3 23.16,25.3 22.44,26.02
  Top 1.27: U4.2 3.94,21.44 5.03,22.53 JP1.3 10.19,22.45 V33.TP
  Bottom 0.152: v53.42,33.68 53.42,33.3 51.59,31.47 51.33,31.01
  Bottom 1.016: v47.93,30.94 47.17,30.18 42.22,30.18 v41.38,31.01 | v51.31,31.01 51.33,31.01
  pour Top (no thermals): 17.98,20.24 17.98,19.33 18.01,19.3 19.35,19.3 19.35,20.22 19.33,20.24
V50
  Top 0.508: 6.79,8.65 6.4,9.04 6.4,10.11
  Top 0.762: X1.1 6.79,8.65 | 6.4,10.11 V50.TP
  Top 1.016: JP3.1 15.34,17.96 JP1.1 | V50.TP 11.33,16.75 11.53,16.95
  Top 1.27: U4.3 7.1,18.87 C1.2 11.53,16.95 11.75,16.95 12.75,17.96 JP3.1
VMOTOR  (via drill 0.6)
  Top 0.152: HBRIDGE.24 17.12,16.82 v17.12,16.43
  Top 1.016: JP1.2 12.78,22.53 12.78,24.69 18.67,24.69 HBRIDGE.13
  Bottom 1.016: v17.12,16.43 16.66,16.43 16.66,20.12 12.8,20.12 JP1.2
  pour Top (no thermals): 19.38,23.14 19.38,24.64 17.6,24.64 17.58,24.61 17.58,23.16 17.6,23.14
  pour Top (no thermals): 16.79,15.98 19.3,15.98 19.3,16.94 16.79,16.94
XRES  (via drill 0.33)
  Top 0.152: v17.37,12.12 18.52,12.12 R11.2 | v29.64,10.06 29.64,8.08 30.25,7.47 30.71,7.47 U1.29 | v28.65,13.34 28.65,14.17 26.75,16.08 23.47,16.08 v21.87,17.68 | v10.36,26.59 10.29,26.52 5.18,26.52 4.19,27.51 1.83,27.51 S1.1
  Bottom 0.152: JP3.3 15.62,12.88 15.85,12.65 16.15,12.65 16.69,12.12 v17.37,12.12 19.05,13.79 19.05,18.9 19.62,19.47 | v29.64,10.06 29.64,12.34 v28.65,13.34 | v21.87,17.68 20.5,19.05 20.5,19.13 20.12,19.51 19.66,19.51 19.62,19.47 | v10.36,26.59 11.12,26.59 13.41,24.31 15.24,24.31 19.58,19.96 19.58,19.51 19.62,19.47

### Text on the board
tNames: SCL | GND | V33 | SDA | BUZZER 1 | V5 | GND | V50 | XRES | SCL | SWD | BUZZER 0 | iotexpert.com | Newton's / Attic
bNames: + | + | www.iotexpert.com | - | - | 3 / 3 | 2 / 3 | 1 / 3 | 0 / 3 | 3 / 2 | 2 / 2 | 1 / 2 | 0 / 2 | 3 / 1 | 2 / 1 | 1 / 1 | 0 / 1 | 3 / 0 | 2 / 0 | 1 / 0 | 0 / 0 | ROW / COL | 2 / 2 | 1 / 2 | 0 / 2 | 2 / 1 | 1 / 1 | 0 / 1 | 2 / 0 | 1 / 0 | 0 / 0 | COL / ROW | Pinball Wizard 1.2 | V33 | V50 | V50 | GND | XRES | SCLK | SWDIO | Newton's Attic